# Altium schematic sheet Block diagram.SchDoc
size A3; SheetNumber: 1; SheetTotal: 5
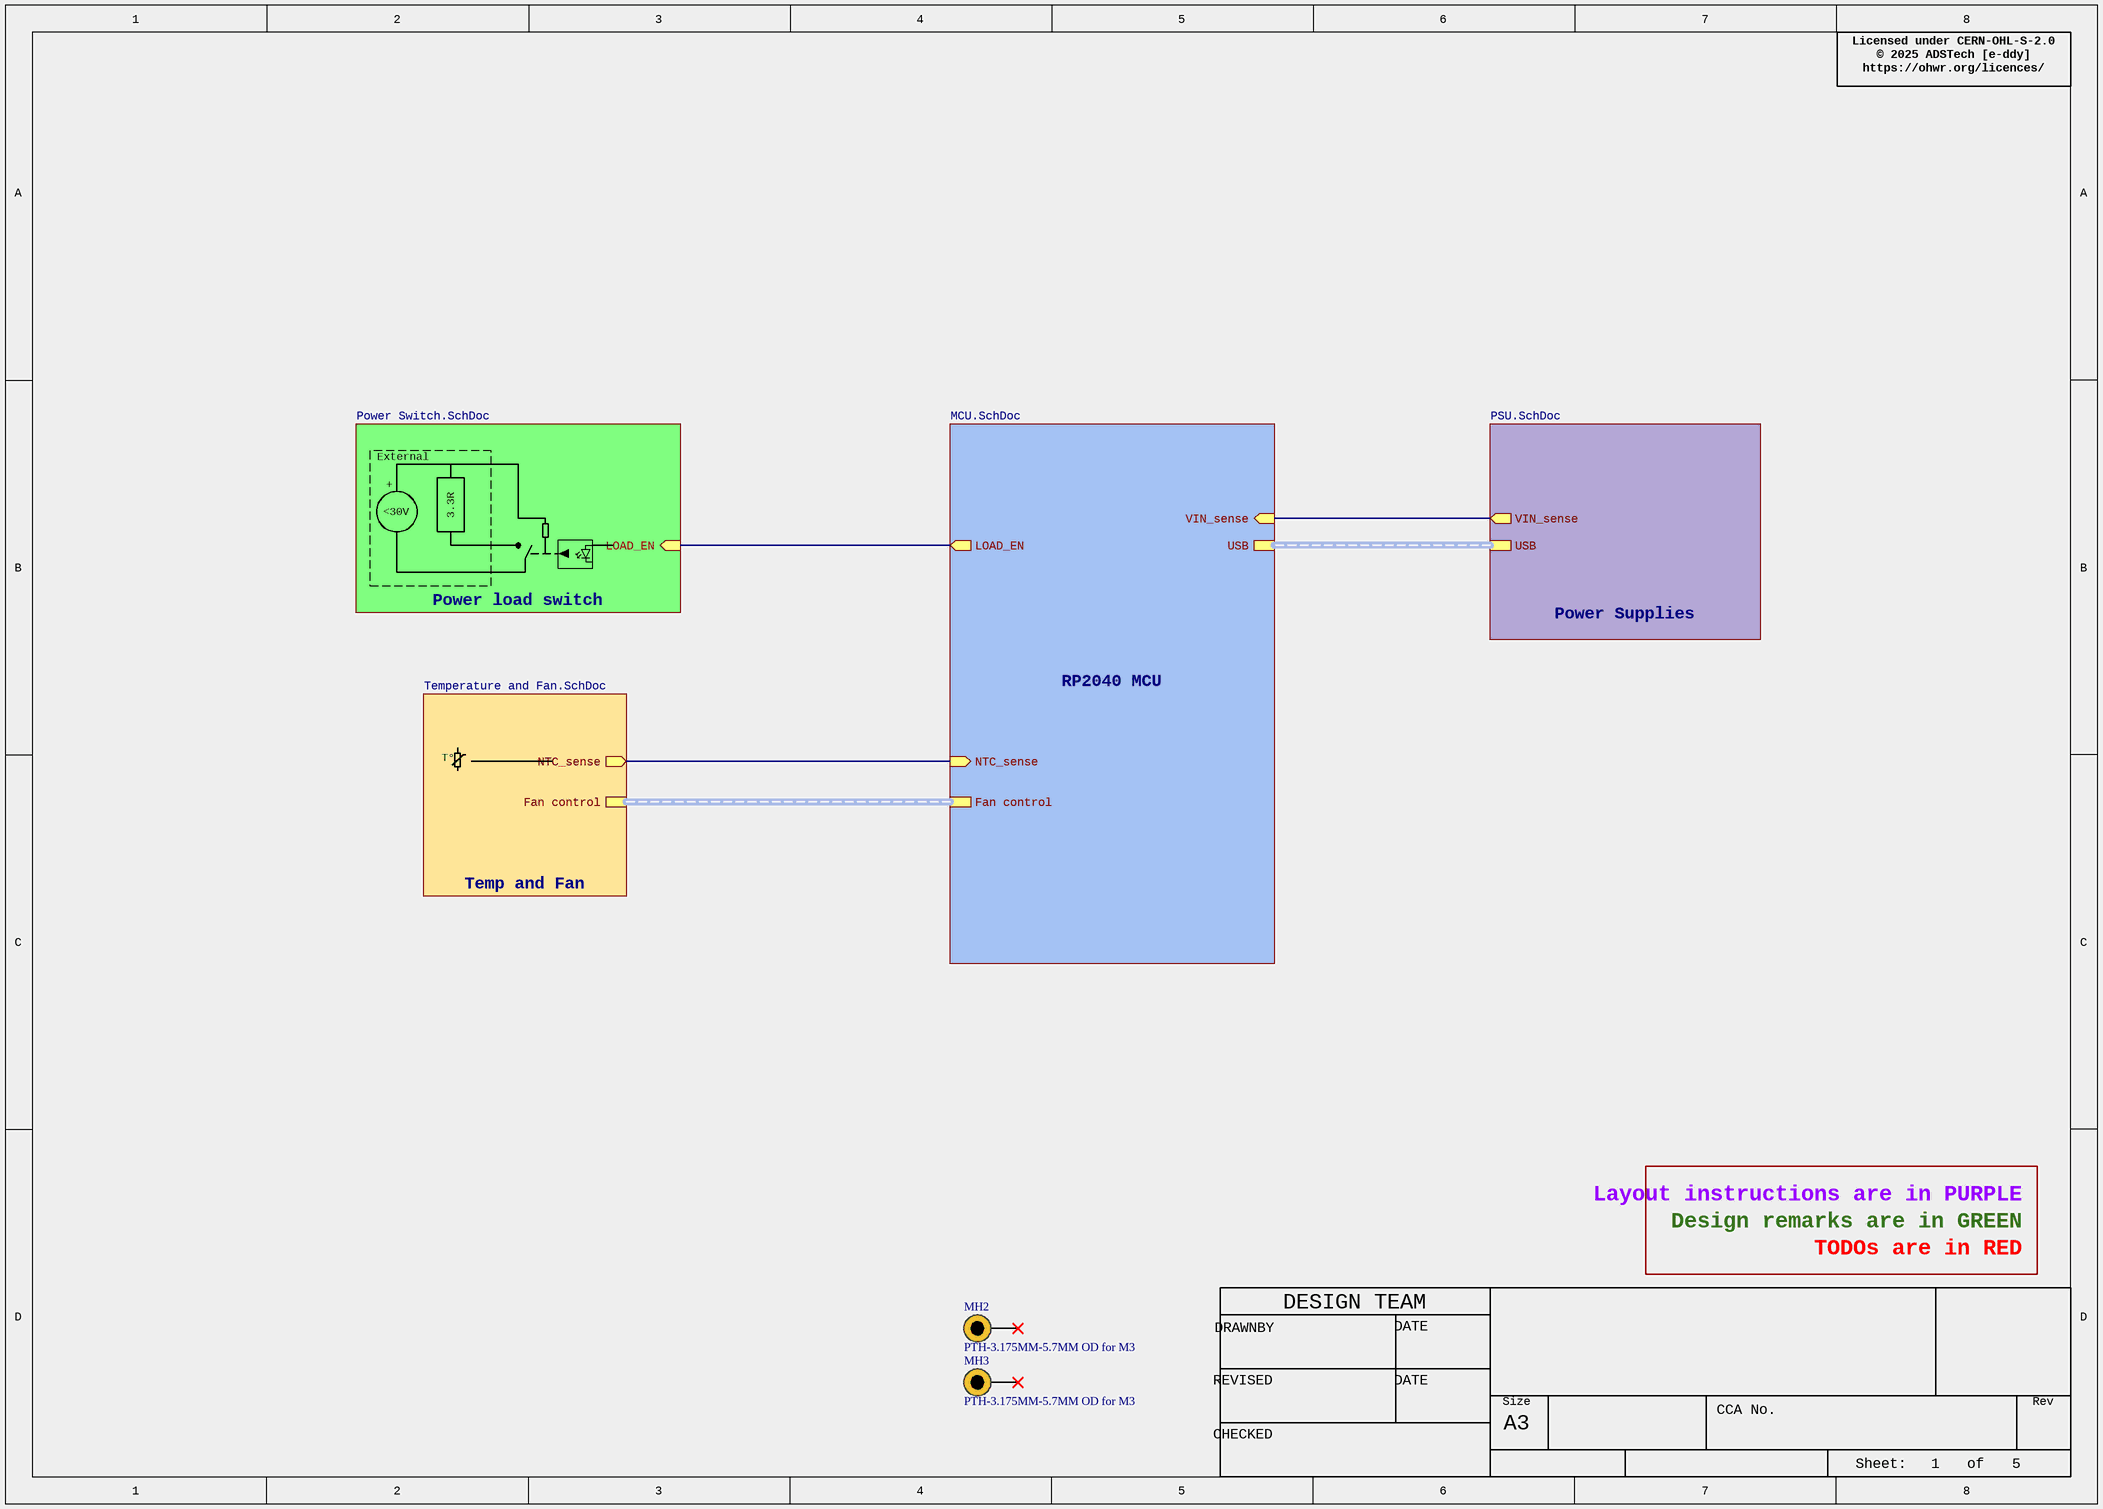
[diagram p0: Block diagram.SchDoc]

## Parts
MH2  PTH-3.175MM-5.7MM OD for M3  [PTH-3.175MM-5.7MM]  (net tie, no BOM)
MH3  PTH-3.175MM-5.7MM OD for M3  [PTH-3.175MM-5.7MM]  (net tie, no BOM)

## Sub-sheets
Power load switch = Power Switch.SchDoc: LOAD_EN (in)
Power Supplies = PSU.SchDoc: VIN_sense (out), USB (harness USB)
RP2040 MCU = MCU.SchDoc: Fan control (harness FAN_ctrl), LOAD_EN (out), NTC_sense (in), USB (harness USB), VIN_sense (in)
Temp and Fan = Temperature and Fan.SchDoc: Fan control (harness FAN_ctrl), NTC_sense (out)

## Nets
(unnamed): sheet Power load switch/LOAD_EN, sheet RP2040 MCU/LOAD_EN
(unnamed): sheet Power Supplies/VIN_sense, sheet RP2040 MCU/VIN_sense
(unnamed): sheet RP2040 MCU/NTC_sense, sheet Temp and Fan/NTC_sense

Not connected (* = marked no-connect by the designer): MH2 0*; MH3 0*

## Buses and harness runs
harness sheet Power Supplies/USB = sheet RP2040 MCU/USB
harness sheet RP2040 MCU/Fan control = sheet Temp and Fan/Fan control

## Notes on the sheet
- Licensed under CERN-OHL-S-2.0
  © 2025 ADSTech [e-ddy]
  https://ohwr.org/licences/
- External
- +
- <30V
- 3.3R
- T°
- Layout instructions are in PURPLE
- Design remarks are in GREEN
- TODOs are in RED
- DESIGN TEAM
- REVISED
- DRAWNBY
- DATE
- CHECKED
- Size
- A3
- CCA No.
- Sheet:
- of
- Rev

## Library data of the parts
MH2 MH3 = CMP-015-000006-2: 3.175mm/5.7mm PLATED TROUGH HOLE. For M3 Cylindrical hex screw head